# EAGLE schematic one_dollar_boad_rev4 (EAGLE 7.5.0)
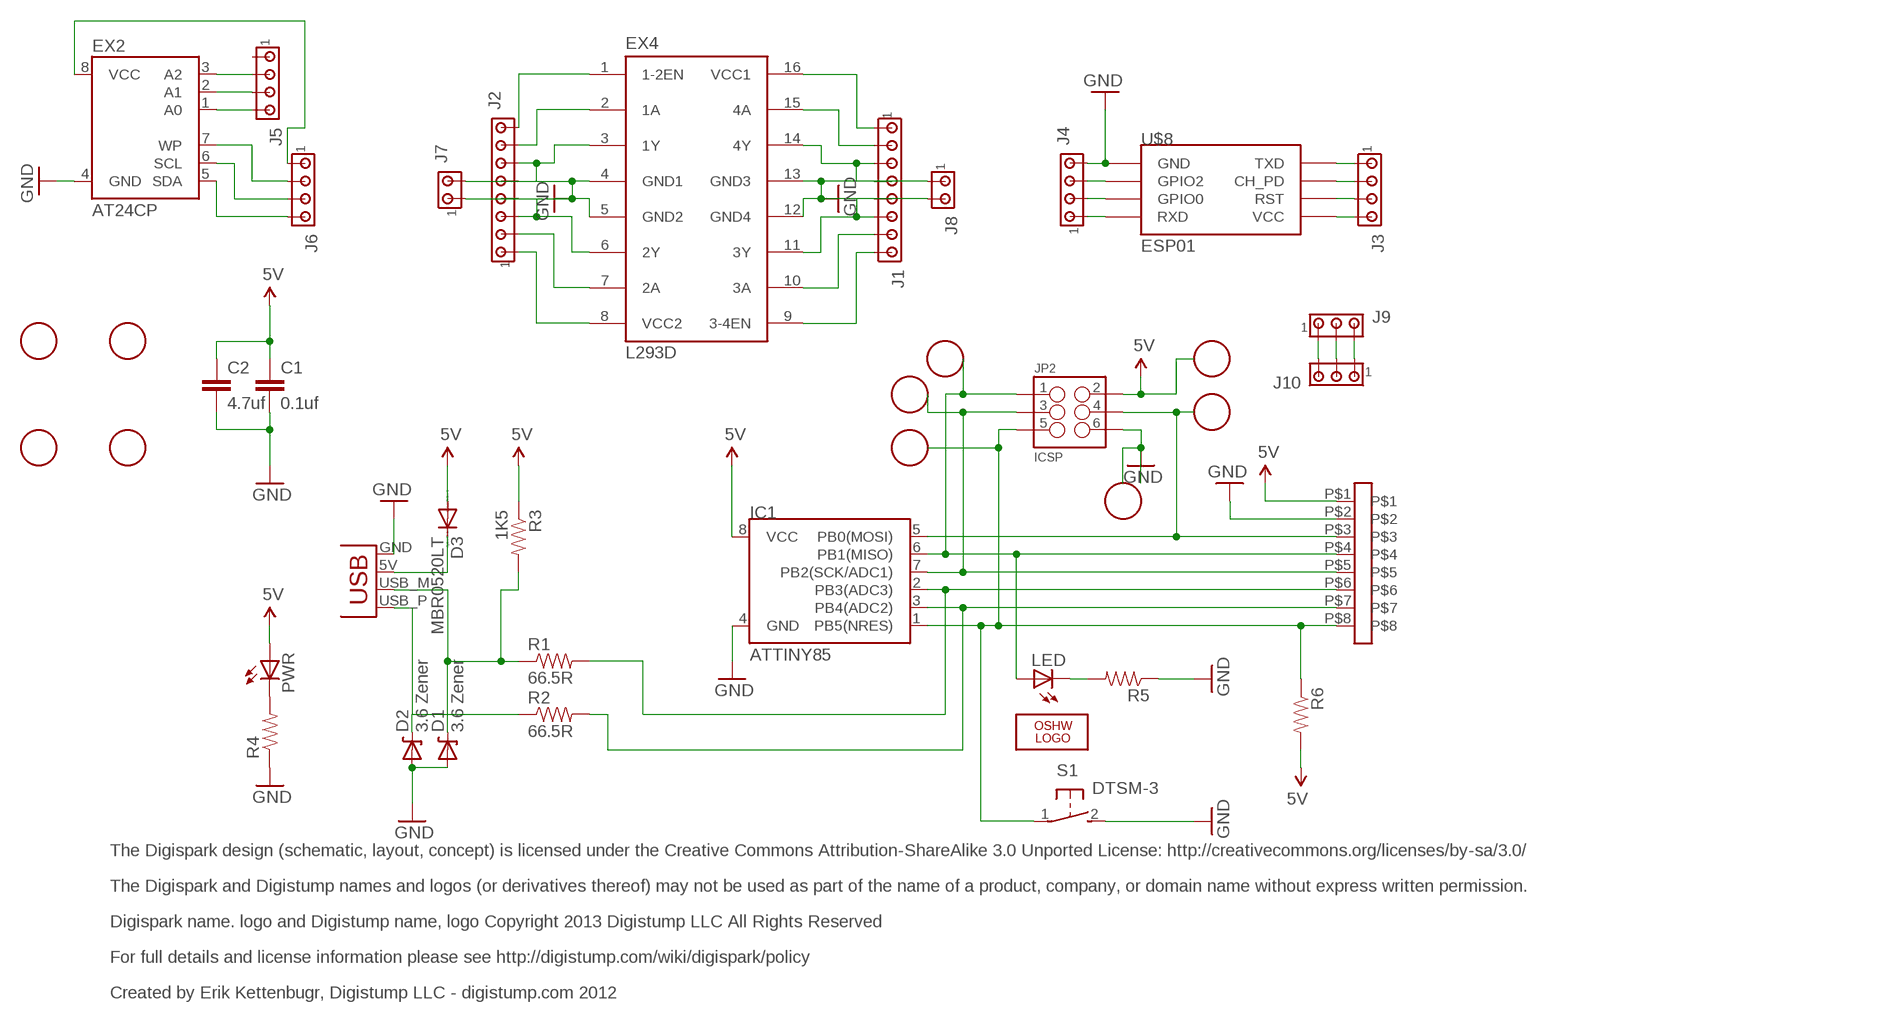
[diagram p0: schematic, sheet 1]

## Parts
C1  0.1uf  CAP0402-CAP  [0402-CAP]
C2  4.7uf  CAP0805  [0805]
CONNECTORBAR1  FAMALEBAR01X08  [FEMEABARRA01X08]
D1  3.6 Zener  DIODE-ZENER-BZT52  [SOD-323]
D2  3.6 Zener  DIODE-ZENER-BZT52  [SOD-323]
D3  MBR0520LT  [SOD123]
EX2  AT24CP  [DIL08]
EX4  L293D  [DIL16]
IC1  ATTINY85  ATTINY45  [SO08-EIAJ]
ICSP1  ICSP  [ICSP]
ICSP2  ICSP  [ICSP]
ICSP3  ICSP  [ICSP]
ICSP4  ICSP  [ICSP]
ICSP5  ICSP  [ICSP]
ICSP6  ICSP  [ICSP]
J1  MTA08-100  [10X08MTA]
J2  MTA08-100  [10X08MTA]
J3  MTA04-100  [10X04MTA]
J4  MTA04-100  [10X04MTA]
J5  MTA04-100  [10X04MTA]
J6  MTA04-100  [10X04MTA]
J7  MTA02-100  [10X02MTA]
J8  MTA02-100  [10X02MTA]
J9  MTA03-100  [10X03MTA]
J10  MTA03-100  [10X03MTA]
JP2  ICSP  M03X22X3_SILK_MALE_PTH  [2X3]
LED  LED0603  [LED-0603]
LOGO2  LOGO-OSHW-10MILX0200-NT  [OSHW_10X200_NOTEXT]
PWR  LED0603  [LED-0603]
R1  66.5R  RESISTOR0402-RES  [0402-RES]
R2  66.5R  RESISTOR0402-RES  [0402-RES]
R3  1K5  RESISTOR0402-RES  [0402-RES]
R4  RESISTOR0402-RES  [0402-RES]
R5  RESISTOR0402-RES  [0402-RES]
R6  RESISTOR0402-RES  [0402-RES]
S1  DTSM-3  [DTSM-3]
U$8  ESP01  [ESP01]
U$9  ARDUINOPINAGEM  [ARDUINOPINAGEM]
X1  USBPCB  [USB-A-PCB]

## Nets
5V: C1.1 C2.1 CONNECTORBAR1.P$1 D3.A IC1.8(VCC) JP2.2 PWR.A R3.1 R6.2
GND: C1.2 C2.2 CONNECTORBAR1.P$2 D1.2(A) D2.2(A) EX2.4(GND) EX4.4(GND1) EX4.5(GND2) EX4.12(GND4) EX4.13(GND3) IC1.4(GND) J1.4 J1.5 J2.4 J2.5 J4.4 JP2.6 R4.1 R5.1 S1.2 U$8.GND X1.GND
N$1: J9.1 J10.3
N$2: CONNECTORBAR1.P$3 IC1.5(PB0(MOSI)) JP2.4
N$3: CONNECTORBAR1.P$4 IC1.6(PB1(MISO)) JP2.1 LED.A
N$5: CONNECTORBAR1.P$5 IC1.7(PB2(SCK/ADC1)) JP2.3
N$6: CONNECTORBAR1.P$7 IC1.3(PB4(ADC2)) R2.2
N$7: EX4.1(1-2EN) J2.8
N$9: EX4.2(1A) J2.7
N$10: D1.1(C) R1.1 R3.2 X1.USB_M(D-)
N$11: D2.1(C) R2.1 X1.USB_P(D+)
N$12: LED.C R5.2
N$13: EX2.8(VCC) J6.1
N$14: EX2.7(WP) J6.2
N$15: EX4.3(1Y) J2.6 J7.2
N$16: D3.C X1.5V(VBUS)
N$17: PWR.C R4.2
N$18: EX4.8(VCC2) J2.1
N$19: EX4.7(2A) J2.2
N$20: EX4.6(2Y) J2.3 J7.1
N$21: EX4.16(VCC1) J1.1
N$22: EX4.15(4A) J1.2
N$23: EX2.6(SCL) J6.3
N$24: EX2.5(SDA) J6.4
N$25: EX4.14(4Y) J1.3 J8.1
N$26: EX4.9(3-4EN) J1.8
N$27: EX4.10(3A) J1.7
N$28: EX2.3(A2) J5.2
N$29: J4.3 U$8.GPIO2
N$30: J4.2 U$8.GPIO0
N$31: J4.1 U$8.RX(RXD)
N$32: J3.1 U$8.TX(TXD)
N$33: J3.2 U$8.CH_PD
N$34: J3.3 U$8.RST
N$35: J3.4 U$8.VCC
N$36: EX2.2(A1) J5.3
N$37: EX2.1(A0) J5.4
N$38: EX4.11(3Y) J1.6 J8.2
N$41: J9.2 J10.2
N$46: CONNECTORBAR1.P$6 IC1.2(PB3(ADC3)) R1.2
N$47: CONNECTORBAR1.P$8 IC1.1(PB5(NRES)) JP2.5 R6.1 S1.1
N$48: J9.3 J10.1
Unconnected: J5.1

## Notes on the sheet
- The Digispark design (schematic, layout, concept) is licensed under the Creative Commons Attribution-ShareAlike 3.0 Unported License: http://creativecommons.org/licenses/by-sa/3.0/
- The Digispark and Digistump names and logos (or derivatives thereof) may not be used as part of the name of a product, company, or domain name without express written permission.
- Digispark name. logo and Digistump name, logo Copyright 2013 Digistump LLC All Rights Reserved
- For full details and license information please see http://digistump.com/wiki/digispark/policy
- Created by Erik Kettenbugr, Digistump LLC - digistump.com 2012

## Library data of the parts
C1 C2 = SparkFun:CAP: Capacitor Standard 0603 ceramic capacitor, and 0.1" leaded capacitor.
CONNECTORBAR1 = femeabarra01x08:FAMALEBAR01X08: conector barra femea 01x08 SMD
D1 D2 = SparkFun:DIODE-ZENER: Zener Diode Production Part - 8199 3.4V Zener Voltage
D3 = diode:MBR0520LT: SCHOTTKY BARRIER RECTIFIER Source: http://onsemi.com .. MBR0520LT1-D.pdf
EX2 = atmel:AT24C*: 2-wire serial EEPROM; MPN: AT24C1024BW-SH-B; OC_FARNELL: 1362646; OC_NEWARK: 03P2044
EX4 = st-microelectronics:L293D: PUSH-PULL 4 CHANNEL DRIVER; MPN: L293D; OC_FARNELL: 9589619; OC_NEWARK: 56P8249
IC1 = SparkFun:ATTINY45: Atmel ATTiny45
ICSP1-ICSP6 = ICSP:ICSP
J1 J2 = con-amp:MTA08-100: AMP connector
J3-J6 = con-amp:MTA04-100: AMP connector
J7 J8 = con-amp:MTA02-100: AMP connector
J9 J10 = con-amp:MTA03-100: AMP connector
JP2 = SparkFun-Connectors:M03X2: 2x3 .1" header. Shrouded, with keying- CONN-10681 SMT- CONN-11415 Pogo pins- HW-11044; PROD_ID: CONN-09701
LED PWR = SparkFun:LED: LEDs Standard schematic elements and footprints for 5mm, 3mm, 1206, and 0603 sized LEDs. 5mm - Spark Fun Electronics SKU : COM-00529 (and others)
LOGO2 = logo:LOGO-OSHW-10MIL
R1-R6 = SparkFun:RESISTOR: Resistor Basic schematic elements and footprints for 0603, 1206, and PTH resistors.
S1 = switch-tact:DTSM-3
U$8 = esp8266modules:ESP01: ESP8266 Wifi module 01
U$9 = arduinopinagem:ARDUINOPINAGEM
X1 = SparkFun:USB: USB Connectors USB-B-PTH is fully proven SKU : PRT-00139 USB-miniB is fully proven SKU : PRT-00587 USB-A-PCB is untested. USB-A-H is throughly reviewed, but untested. Spark Fun Electronics SKU : PRT-00437 USB-B-SMT is throughly reviewed, but untested. Needs silkscreen touching up. USB-A-S has not been used/tested USB-MB-H has not been used/tested